# EAGLE design RPi_Extension_breakout_jetson_alt (EAGLE 7.6.0)
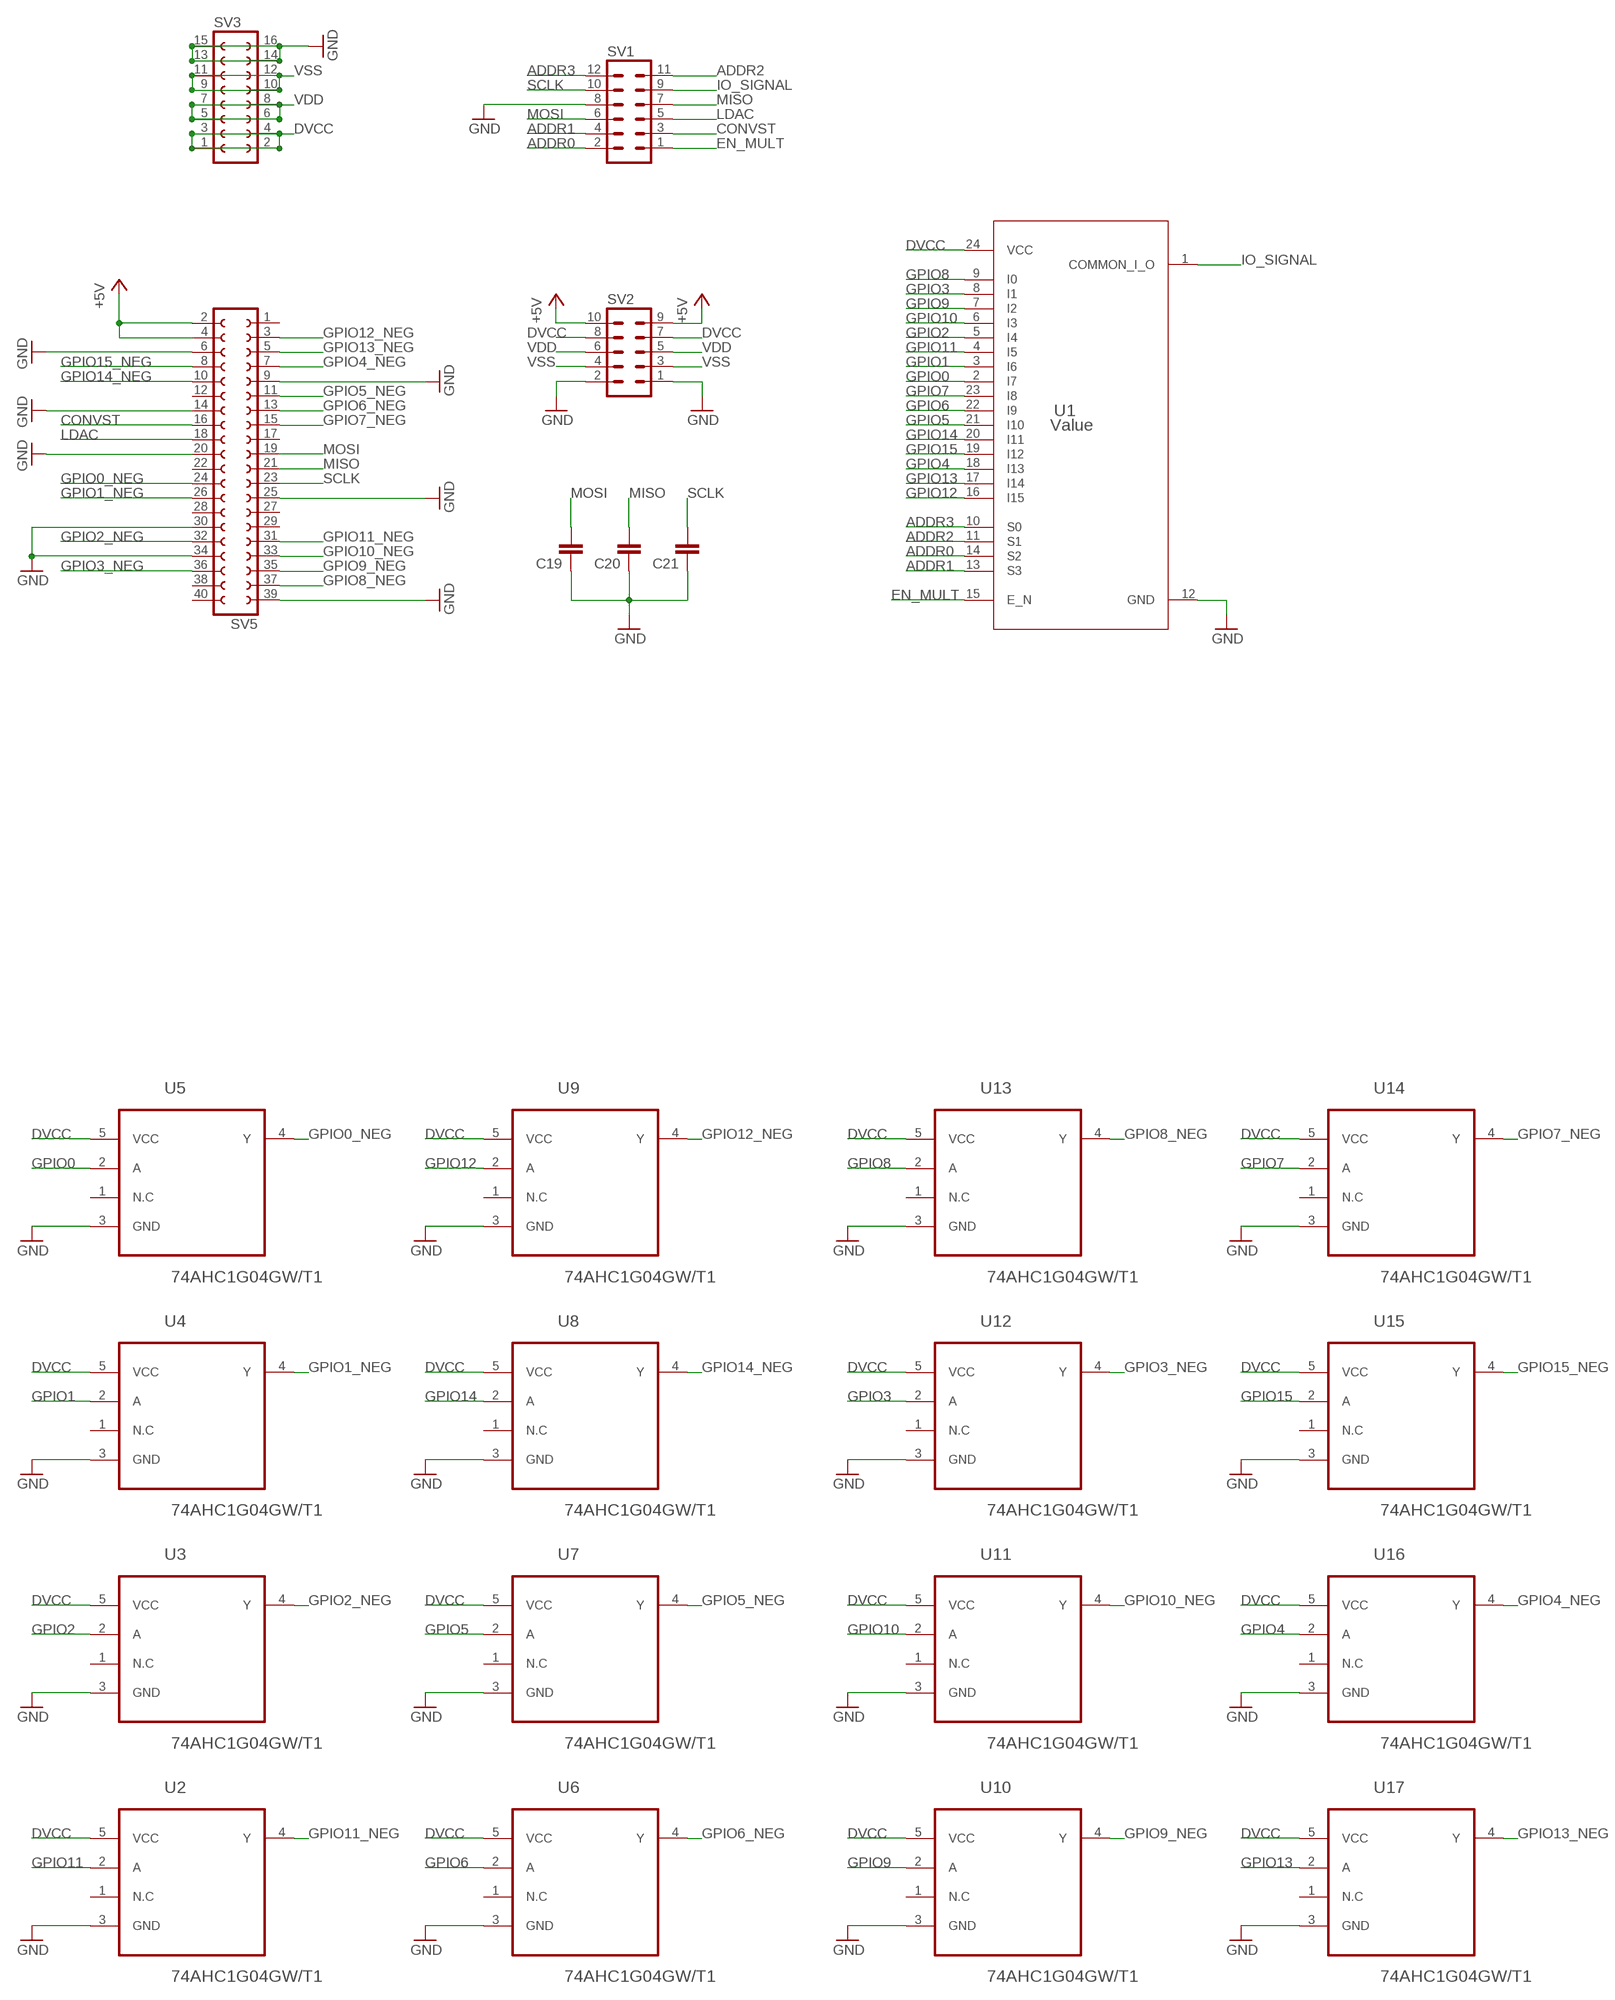
[diagram p0: schematic, sheet 1]

## Parts
C19  C-EUC0603  [C0603]
C20  C-EUC0603  [C0603]
C21  C-EUC0603  [C0603]
SV1  MA06-2  [MA06-2]
SV2  MA05-2  [MA05-2]
SV3  FE08-2  [FE08-2]
SV5  FE20-2  [FE20-2]
U1  Value  CD74HC4067SM96  [DB0024A_N]
U2  74AHC1G04GW/T1  [SOT65P210X110-5N]
U3  74AHC1G04GW/T1  [SOT65P210X110-5N]
U4  74AHC1G04GW/T1  [SOT65P210X110-5N]
U5  74AHC1G04GW/T1  [SOT65P210X110-5N]
U6  74AHC1G04GW/T1  [SOT65P210X110-5N]
U7  74AHC1G04GW/T1  [SOT65P210X110-5N]
U8  74AHC1G04GW/T1  [SOT65P210X110-5N]
U9  74AHC1G04GW/T1  [SOT65P210X110-5N]
U10  74AHC1G04GW/T1  [SOT65P210X110-5N]
U11  74AHC1G04GW/T1  [SOT65P210X110-5N]
U12  74AHC1G04GW/T1  [SOT65P210X110-5N]
U13  74AHC1G04GW/T1  [SOT65P210X110-5N]
U14  74AHC1G04GW/T1  [SOT65P210X110-5N]
U15  74AHC1G04GW/T1  [SOT65P210X110-5N]
U16  74AHC1G04GW/T1  [SOT65P210X110-5N]
U17  74AHC1G04GW/T1  [SOT65P210X110-5N]

## Nets
+5V: SV2.9 SV2.10 SV5.2 SV5.4
ADDR0: SV1.2 U1.14(S2)
ADDR1: SV1.4 U1.13(S3)
ADDR2: SV1.11 U1.11(S1)
ADDR3: SV1.12 U1.10(S0)
CONVST: SV1.3 SV5.16
DVCC: SV2.7 SV2.8 SV3.1 SV3.2 SV3.3 SV3.4 U1.24(VCC) U2.5(VCC) U3.5(VCC) U4.5(VCC) U5.5(VCC) U6.5(VCC) U7.5(VCC) U8.5(VCC) U9.5(VCC) U10.5(VCC) U11.5(VCC) U12.5(VCC) U13.5(VCC) U14.5(VCC) U15.5(VCC) U16.5(VCC) U17.5(VCC)
EN_MULT: SV1.1 U1.15(E_N)
GND: C19.1 C20.1 C21.1 SV1.8 SV2.1 SV2.2 SV3.13 SV3.14 SV3.15 SV3.16 SV5.6 SV5.9 SV5.14 SV5.20 SV5.25 SV5.30 SV5.34 SV5.39 U1.12(GND) U2.3(GND) U3.3(GND) U4.3(GND) U5.3(GND) U6.3(GND) U7.3(GND) U8.3(GND) U9.3(GND) U10.3(GND) U11.3(GND) U12.3(GND) U13.3(GND) U14.3(GND) U15.3(GND) U16.3(GND) U17.3(GND)
GPIO0: U1.2(I7) U5.2(A)
GPIO0_NEG: SV5.24 U5.4(Y)
GPIO1: U1.3(I6) U4.2(A)
GPIO1_NEG: SV5.26 U4.4(Y)
GPIO2: U1.5(I4) U3.2(A)
GPIO2_NEG: SV5.32 U3.4(Y)
GPIO3: U1.8(I1) U12.2(A)
GPIO3_NEG: SV5.36 U12.4(Y)
GPIO4: U1.18(I13) U16.2(A)
GPIO4_NEG: SV5.7 U16.4(Y)
GPIO5: U1.21(I10) U7.2(A)
GPIO5_NEG: SV5.11 U7.4(Y)
GPIO6: U1.22(I9) U6.2(A)
GPIO6_NEG: SV5.13 U6.4(Y)
GPIO7: U1.23(I8) U14.2(A)
GPIO7_NEG: SV5.15 U14.4(Y)
GPIO8: U1.9(I0) U13.2(A)
GPIO8_NEG: SV5.37 U13.4(Y)
GPIO9: U1.7(I2) U10.2(A)
GPIO9_NEG: SV5.35 U10.4(Y)
GPIO10: U1.6(I3) U11.2(A)
GPIO10_NEG: SV5.33 U11.4(Y)
GPIO11: U1.4(I5) U2.2(A)
GPIO11_NEG: SV5.31 U2.4(Y)
GPIO12: U1.16(I15) U9.2(A)
GPIO12_NEG: SV5.3 U9.4(Y)
GPIO13: U1.17(I14) U17.2(A)
GPIO13_NEG: SV5.5 U17.4(Y)
GPIO14: U1.20(I11) U8.2(A)
GPIO14_NEG: SV5.10 U8.4(Y)
GPIO15: U1.19(I12) U15.2(A)
GPIO15_NEG: SV5.8 U15.4(Y)
IO_SIGNAL: SV1.9 U1.1(COMMON_I_O)
LDAC: SV1.5 SV5.18
MISO: C20.2 SV1.7 SV5.21
MOSI: C19.2 SV1.6 SV5.19
SCLK: C21.2 SV1.10 SV5.23
VDD: SV2.5 SV2.6 SV3.5 SV3.6 SV3.7 SV3.8
VSS: SV2.3 SV2.4 SV3.9 SV3.10 SV3.11 SV3.12
Unconnected: SV5.1 SV5.12 SV5.17 SV5.22 SV5.27 SV5.28 SV5.29 SV5.38 SV5.40 U2.1(N.C) U3.1(N.C) U4.1(N.C) U5.1(N.C) U6.1(N.C) U7.1(N.C) U8.1(N.C) U9.1(N.C) U10.1(N.C) U11.1(N.C) U12.1(N.C) U13.1(N.C) U14.1(N.C) U15.1(N.C) U16.1(N.C) U17.1(N.C)

## Library data of the parts
C19-C21 = rcl:C-EU: CAPACITOR, European symbol
SV1 = con-lstb:MA06-2: PIN HEADER; OC_FARNELL: unknown; OC_NEWARK: unknown
SV2 = con-lstb:MA05-2: PIN HEADER; OC_FARNELL: unknown; OC_NEWARK: unknown
SV3 = con-lsta:FE08-2: FEMALE HEADER; OC_FARNELL: unknown; OC_NEWARK: unknown
SV5 = con-lsta:FE20-2: FEMALE HEADER; OC_FARNELL: unknown; OC_NEWARK: unknown
U1 = CD74HC4067:CD74HC4067SM96; MANUFACTURER: Texas Instruments; PARTNUMBER: CD74HC4067SM96; REFDES: RefDes; TYPE: TYPE
U2-U17 = 74AHC1G04GW:74AHC1G04GW/T1: Inverter; MPN: 74AHC1G04GW/T1; OC_FARNELL: 1085239; OC_NEWARK: 99K0513; PACKAGE: SOT353-1-5; SUPPLIER: NXP

## Board
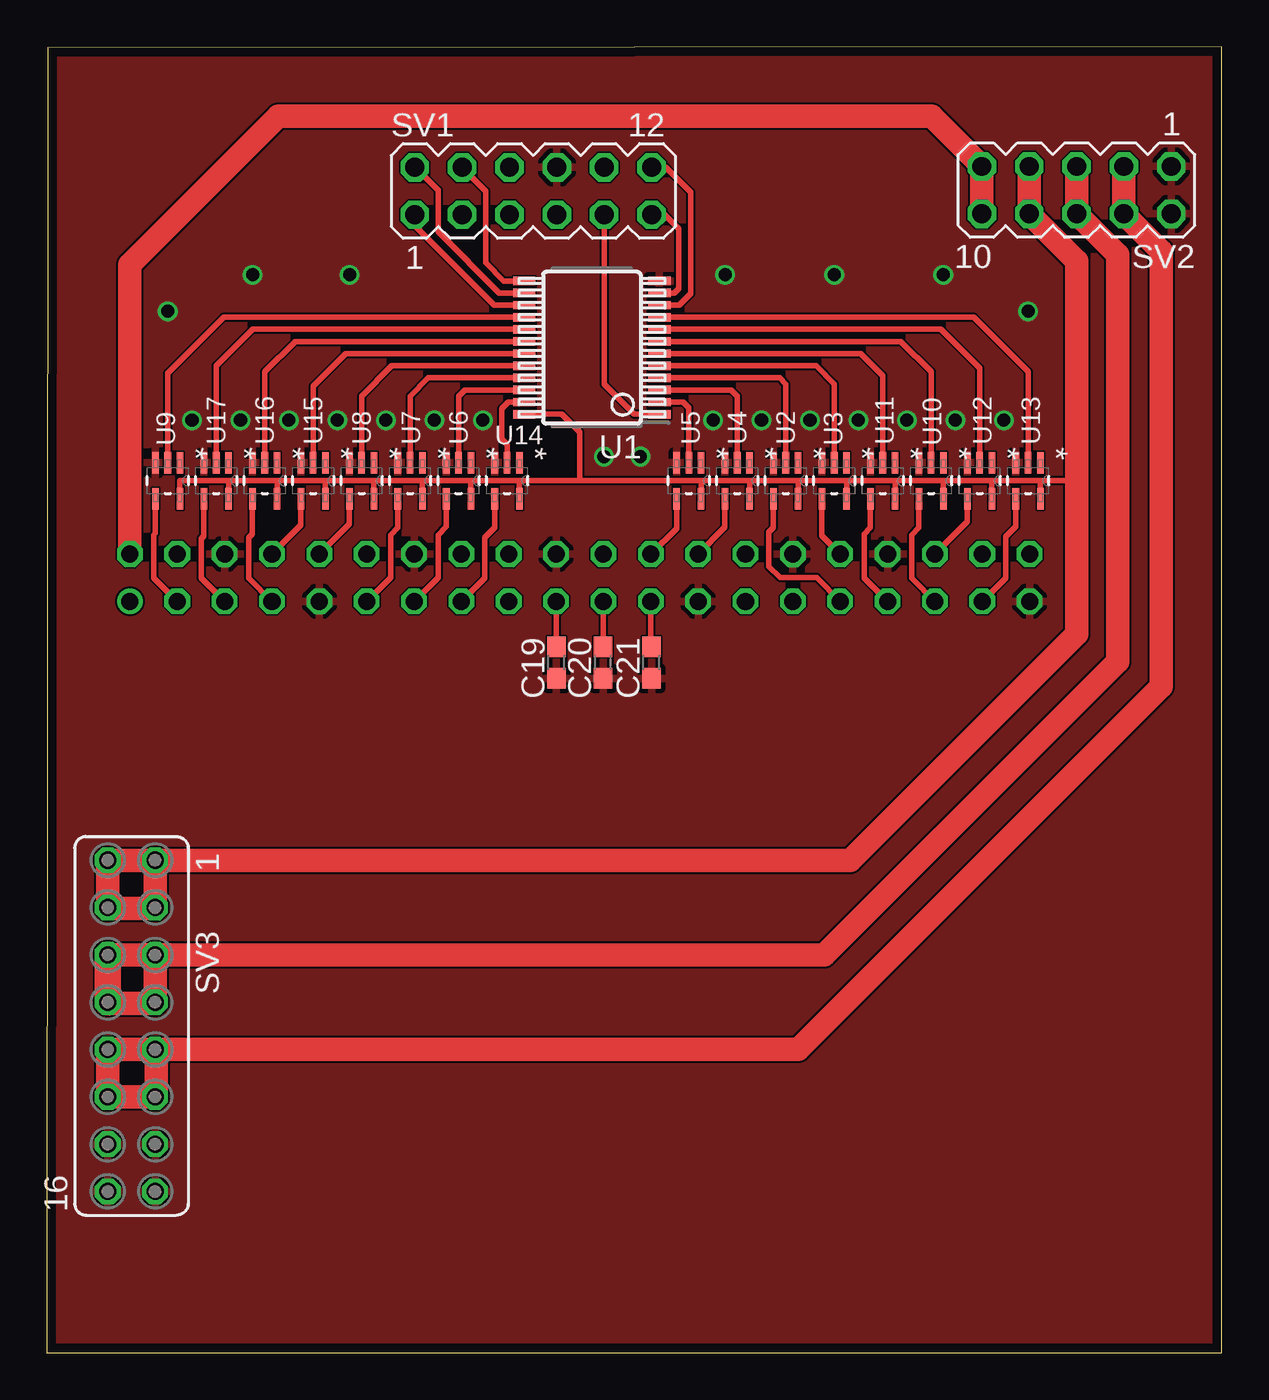
[diagram p1: board, top side]
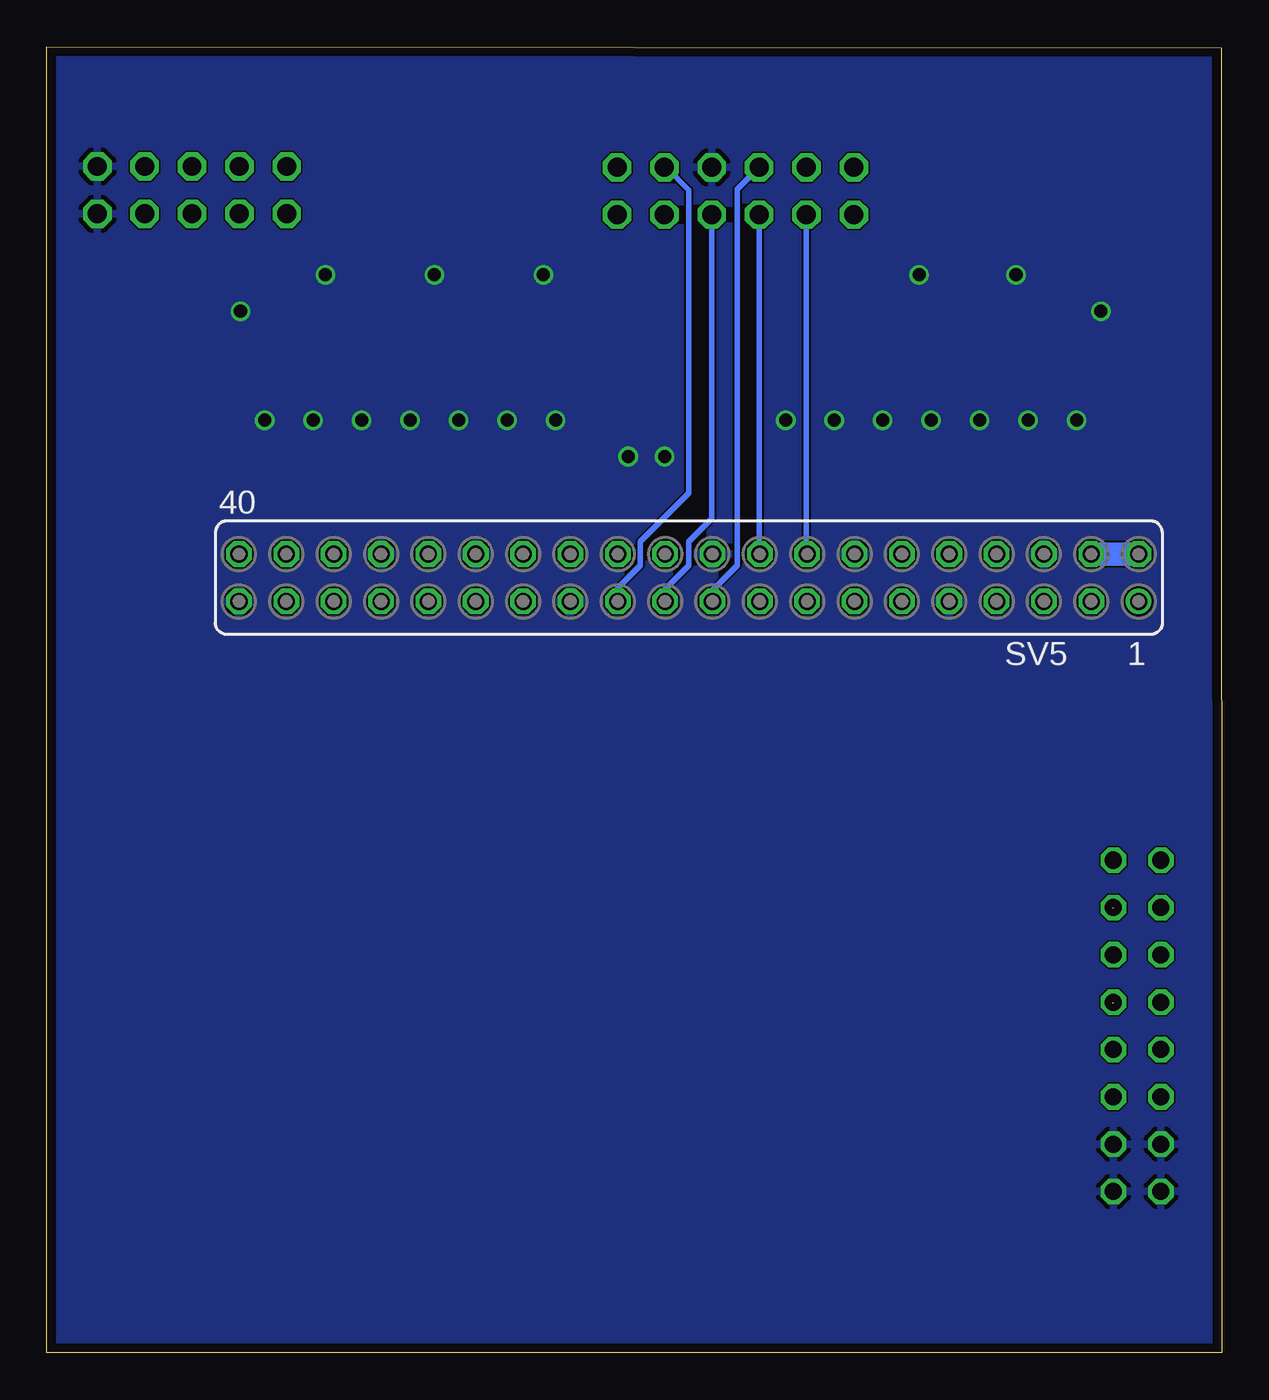
[diagram p2: board, bottom side, seen from below]

Size 63.05 x 70.1 mm. Coordinates in mm from the lower left corner, seen from the top.
Outline: 0,0 63.05,0 63.05,70.1 0.05,70.05 0,0
Copper layers (1*16): Top 0.035mm / dielectric 1.53mm / Bottom 0.035mm
Design rules "pban_4mil-l2": minimum track width 0.1mm, minimum drill 0.3mm, track to track 0.1mm, track to pad 0.229mm, pad to pad 0.1mm, via to via 0.1mm, smd to smd 0.1mm, copper to edge 0.5mm, drill to drill 0.5mm, minimum pad ring 0.15mm, minimum via ring 0.15mm, stop-mask expansion 4mil, vias tented up to drill 0.35mm, thermal gap 10mil

### Footprints (pad centres in the part's own frame; a part is rotated, then mirrored left to right if it is on the bottom)
C0603 = smd 1.1 x 1: 1 -0.85,0; 2 0.85,0
MA06-2 = drill 1.016 octagon: 1 -6.35,-1.27; 2 -6.35,1.27; 3 -3.81,-1.27; 4 -3.81,1.27; 5 -1.27,-1.27; 6 -1.27,1.27; 7 1.27,-1.27; 8 1.27,1.27; 9 3.81,-1.27; 10 3.81,1.27; 11 6.35,-1.27; 12 6.35,1.27
MA05-2 = drill 1.016 octagon: 1 -5.08,-1.27; 2 -5.08,1.27; 3 -2.54,-1.27; 4 -2.54,1.27; 5 0,-1.27; 6 0,1.27; 7 2.54,-1.27; 8 2.54,1.27; 9 5.08,-1.27; 10 5.08,1.27
FE08-2 = drill 0.914 octagon: 1 -8.89,1.27; 2 -8.89,-1.27; 3 -6.35,1.27; 4 -6.35,-1.27; 5 -3.81,1.27; 6 -3.81,-1.27; 7 -1.27,1.27; 8 -1.27,-1.27; 9 1.27,1.27; 10 1.27,-1.27; 11 3.81,1.27; 12 3.81,-1.27; 13 6.35,1.27; 14 6.35,-1.27; 15 8.89,1.27; 16 8.89,-1.27
FE20-2 = drill 0.914: 1 -24.13,1.27 | drill 0.914 octagon: 2 -24.13,-1.27; 3 -21.59,1.27; 4 -21.59,-1.27; 5 -19.05,1.27; 6 -19.05,-1.27; 7 -16.51,1.27; 8 -16.51,-1.27; 9 -13.97,1.27; 10 -13.97,-1.27; 11 -11.43,1.27; 12 -11.43,-1.27; 13 -8.89,1.27; 14 -8.89,-1.27; 15 -6.35,1.27; 16 -6.35,-1.27; 17 -3.81,1.27; 18 -3.81,-1.27; 19 -1.27,1.27; 20 -1.27,-1.27; 21 1.27,1.27; 22 1.27,-1.27; 23 3.81,1.27; 24 3.81,-1.27; 25 6.35,1.27; 26 6.35,-1.27; 27 8.89,1.27; 28 8.89,-1.27; 29 11.43,1.27; 30 11.43,-1.27; 31 13.97,1.27; 32 13.97,-1.27; 33 16.51,1.27; 34 16.51,-1.27; 35 19.05,1.27; 36 19.05,-1.27; 37 21.59,1.27; 38 21.59,-1.27; 39 24.13,1.27; 40 24.13,-1.27
DB0024A_N = smd 1.2 x 0.45: 1 -3.625,3.575; 2 -3.625,2.925; 3 -3.625,2.275; 4 -3.625,1.625; 5 -3.625,0.975; 6 -3.625,0.325; 7 -3.625,-0.325; 8 -3.625,-0.975; 9 -3.625,-1.625; 10 -3.625,-2.275; 11 -3.625,-2.925; 12 -3.625,-3.575; 13 3.625,-3.575; 14 3.625,-2.925; 15 3.625,-2.275; 16 3.625,-1.625; 17 3.625,-0.975; 18 3.625,-0.325; 19 3.625,0.325; 20 3.625,0.975; 21 3.625,1.625; 22 3.625,2.275; 23 3.625,2.925; 24 3.625,3.575
SOT65P210X110-5N = smd 1.168 x 0.356: 1 -0.965,0.66; 2 -0.965,0; 3 -0.965,-0.66; 4 0.965,-0.66; 5 0.965,0.66

### Placement (x,y rotation side)
C19  27.35,37.05 90 top
C20  29.85,37.05 90 top
C21  32.45,37.05 90 top
SV1  26.1,62.35 0 top
SV2  55.25,62.4 180 top
SV3  4.55,17.55 270 top
SV5  28.6,41.6 180 bottom
U1  29.25,53.95 180 top
U2  39.65,46.8 270 top
U3  42.25,46.8 270 top
U4  37.05,46.8 270 top
U5  34.45,46.8 270 top
U6  22.1,46.8 270 top
U7  19.5,46.8 270 top
U8  16.9,46.8 270 top
U9  6.5,46.8 270 top
U10  47.45,46.8 270 top
U11  44.85,46.8 270 top
U12  50.05,46.8 270 top
U13  52.65,46.8 270 top
U14  24.7,46.8 270 top
U15  14.3,46.8 270 top
U16  11.7,46.8 270 top
U17  9.1,46.8 270 top

### Tracks (layer width: path | path; a pad name or v marks a point on that pad's centre or on a via)
+5V
  Top 1.27: SV2.10 SV2.9 47.47,66.37 12.43,66.37 4.47,58.41 SV5.2
  Bottom 1.27: SV5.2 SV5.4
ADDR0
  Top 0.305: SV1.2 19.78,63.62 21,62.4 21,60.16 24.28,56.88 U1.14
ADDR1
  Top 0.305: SV1.4 23.55,62.35 23.55,58.5 24.52,57.52 U1.13
ADDR2
  Top 0.305: U1.11 33.68,56.88 33.91,57.11 33.91,60.34 33.17,61.08 SV1.11
ADDR3
  Top 0.305: U1.10 33.93,56.23 34.54,56.84 34.54,62.29 33.21,63.62 SV1.12
CONVST
  Bottom 0.305: SV1.3 22.29,42.91 SV5.16
DVCC  (1 unrouted)
  Top 0.305: 28.6,26.79 22.2,26.54 22.1,26.44 | U5.5 35.11,46.79 | 35.11,46.79 35.1,46.8 28.6,46.8 | U4.5 37.71,46.79 | 37.71,46.79 37.7,46.8 35.12,46.8 35.11,46.79 | U2.5 40.31,46.79 40.3,46.8 | 40.3,46.8 37.72,46.8 37.71,46.79 | U3.5 42.91,46.79 | 42.91,46.79 42.9,46.8 40.3,46.8 | U11.5 45.51,46.79 45.5,46.8 | 45.5,46.8 42.92,46.8 42.91,46.79 | U12.5 50.71,46.79 | 50.71,46.79 50.7,46.8 48.1,46.8 | 48.1,46.8 45.5,46.8 | U10.5 48.11,46.79 48.1,46.8 | 53.3,46.8 50.72,46.8 50.71,46.79 | U14.5 25.36,46.79 25.35,46.8 | U6.5 22.76,46.79 22.75,46.8 | 22.75,46.8 25.35,46.8 | U7.5 20.16,46.79 20.15,46.8 | 20.15,46.8 22.75,46.8 | U8.5 17.56,46.79 17.55,46.8 | 17.55,46.8 20.15,46.8 | U15.5 14.96,46.79 14.95,46.8 | 14.95,46.8 17.55,46.8 | U16.5 12.36,46.79 12.35,46.8 | 12.35,46.8 14.95,46.8 | U17.5 9.76,46.79 9.75,46.8 | 9.75,46.8 12.35,46.8 | U9.5 7.15,46.8 9.75,46.8 | 25.35,46.8 28.6,46.8 | U13.5 53.31,46.79 53.3,46.8 | 53.3,46.8 55.25,46.8 | U1.24 27.62,50.38 28.6,49.4 28.6,46.8
  Top 1.27: SV3.1 SV3.3 | SV3.1 22.1,26.44 43.1,26.44 55.25,38.59 55.25,46.8 55.25,58.59 SV2.8 SV2.7 | SV3.1 SV3.2 SV3.4 | 5.82,23.84 3.28,23.84
EN_MULT
  Top 0.305: U1.15 24.01,56.23 19.75,60.49 SV1.1
GND  (via drill 0.7)
  other vias: 7.8,50.05 10.4,50.05 13,50.05 15.6,50.05 18.2,50.05 20.8,50.05 35.75,50.05 38.35,50.05 40.95,50.05 43.55,50.05 46.15,50.05 48.75,50.05 51.35,50.05 23.4,50.05 6.5,55.9 52.65,55.9 16.25,57.85 36.4,57.85 42.25,57.85 11.05,57.85 48.1,57.85 29.9,48.1 31.85,48.1
  pour Top: -0.65,-0.65 63.7,-0.65 63.7,72.15 -0.65,72.15
  pour Bottom: 0,0 0.65,70.85 63.7,70.85 63.05,0
GPIO0
  Top 0.305: U5.2 34.45,50.73 34.16,51.02 U1.2
GPIO0_NEG
  Top 0.305: SV5.24 33.79,44.25 U5.4
GPIO1
  Top 0.305: U1.3 36.73,51.67 37.05,51.35 U4.2
GPIO1_NEG
  Top 0.305: U4.4 36.39,44.31 SV5.26
GPIO2
  Top 0.305: U1.5 41.27,52.98 42.25,52 U3.2
GPIO2_NEG
  Top 0.305: U3.4 41.59,43.85 SV5.32
GPIO3
  Top 0.305: U12.2 50.05,52.84 47.97,54.92 U1.8
GPIO3_NEG
  Top 0.305: U12.4 49.39,44.61 SV5.36
GPIO4
  Top 0.305: U16.2 11.7,52.65 13.32,54.27 U1.18
GPIO4_NEG
  Top 0.305: U16.4 11.04,43.94 10.85,43.75 10.85,41.57 SV5.7
GPIO5
  Top 0.305: U1.21 20.48,52.33 19.5,51.35 U7.2
GPIO5_NEG
  Top 0.305: U7.4 18.84,44.29 18.45,43.9 18.45,41.61 SV5.11
GPIO6
  Top 0.305: U1.22 22.43,51.67 22.1,51.35 U6.2
GPIO6_NEG
  Top 0.305: U6.4 21.44,44.34 21,43.9 21,41.62 SV5.13
GPIO7
  Top 0.305: U1.23 24.76,51.02 24.41,50.68 24.41,49.04 24.7,48.75 U14.2
GPIO7_NEG
  Top 0.305: U14.4 24.04,44.29 23.5,43.75 23.5,41.58 SV5.15
GPIO8
  Top 0.305: U1.9 49.73,55.58 52.65,52.65 U13.2
GPIO8_NEG
  Top 0.305: U13.4 51.99,44.34 51.45,43.8 51.45,41.59 SV5.37
GPIO9
  Top 0.305: U1.7 45.83,54.27 47.45,52.65 U10.2
GPIO9_NEG
  Top 0.305: U10.4 46.79,44.29 46.4,43.9 46.4,41.58 SV5.35
GPIO10
  Top 0.305: U11.2 44.85,52.45 43.68,53.62 U1.6
GPIO10_NEG
  Top 0.305: U11.4 44.19,44.29 43.85,43.95 43.85,41.59 SV5.33
GPIO11
  Top 0.305: U1.4 39.33,52.33 39.65,52 U2.2
GPIO11_NEG
  Top 0.305: U2.4 38.99,44.29 38.75,44.05 38.75,42.2 39.35,41.6 41.3,41.6 SV5.31
GPIO12
  Top 0.305: U1.16 9.5,55.58 6.5,52.58 U9.2
GPIO12_NEG
  Top 0.305: U9.4 5.84,43.99 5.75,43.9 5.75,41.59 SV5.3
GPIO13
  Top 0.305: U1.17 11.05,54.92 9.1,52.98 U17.2
GPIO13_NEG
  Top 0.305: U17.4 8.44,43.84 8.3,43.7 8.3,41.58 SV5.5
GPIO14
  Top 0.305: U1.20 18.52,52.98 16.9,51.35 U8.2
GPIO14_NEG
  Top 0.305: U8.4 16.24,44.48 SV5.10
GPIO15
  Top 0.305: U15.2 14.3,51.88 16.05,53.62 U1.19
GPIO15_NEG
  Top 0.305: U15.4 13.64,44.42 SV5.8
IO_SIGNAL
  Top 0.305: U1.1 31.52,50.38 29.91,51.99 SV1.9
LDAC
  Bottom 0.305: SV1.5 24.83,42.91 SV5.18
MISO
  Top 0.305: SV5.21 29.87,37.92
  Top 0.406: 29.87,37.92 C20.2
  Bottom 0.305: SV5.21 29.87,40.98 28.6,42.25 28.6,43.55 27.37,44.78 SV1.7
MOSI
  Top 0.305: SV5.19 27.33,37.92
  Top 0.406: 27.33,37.92 C19.2
  Bottom 0.305: SV5.19 27.33,40.92 26,42.25 26,62.45 SV1.6
SCLK
  Top 0.305: SV5.23 32.41,37.94
  Top 0.406: 32.41,37.94 C21.2
  Bottom 0.305: SV5.23 32.41,41.04 31.2,42.25 31.2,43.55 29.9,44.85 28.6,46.15 28.6,62.4 29.82,63.62 SV1.10
VDD  (1 unrouted)
  Top 1.27: SV2.5 SV2.6 57.45,58.93 57.45,37.1 41.71,21.36 SV3.5 | SV3.5 SV3.6 | SV3.5 SV3.7 | 5.82,18.76 3.28,18.76
  Top 1.422: SV3.6 SV3.8
VSS
  Top 1.27: SV2.3 SV2.4 59.8,59.12 59.8,35.77 40.31,16.28 5.88,16.28 | 5.88,16.28 SV3.9 SV3.10 SV3.12 SV3.11 | 5.88,13.74 5.88,16.28